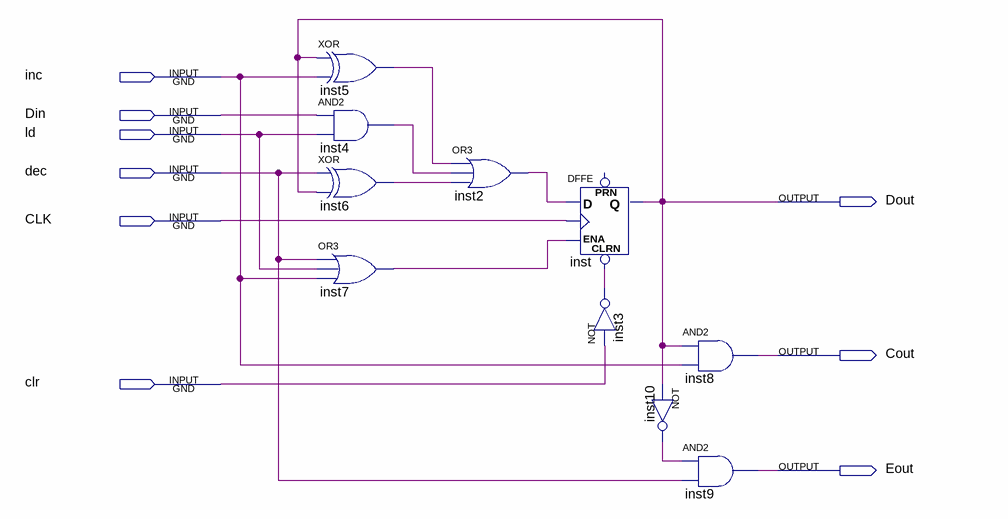
[diagram p0: schematic sheet]
// Quartus schematic reg1_ld_clr_inc_dec.bdf as structural Verilog: 10 symbols, 9 pins
module reg1_ld_clr_inc_dec (
  input  inc,
  input  Din,
  input  ld,
  input  dec,
  input  CLK,
  input  clr,
  output Dout,
  output Cout,
  output Eout
);

  wire inst2_out, inst3_out, inst4_out, inst5_out, inst6_out, inst7_out, inst10_out;

  xor inst5 (inst5_out, Dout, inc);
  and inst4 (inst4_out, Din, ld);
  xor inst6 (inst6_out, dec, Dout);
  or inst7 (inst7_out, dec, ld, inc);
  or inst2 (inst2_out, inst5_out, inst4_out, inst6_out);
  DFFE inst (.CLRN(inst3_out), .D(inst2_out), .CLK(CLK), .ENA(inst7_out), .Q(Dout));  // open: PRN
  not inst3 (inst3_out, clr);
  and inst8 (Cout, Dout, inc);
  not inst10 (inst10_out, Dout);
  and inst9 (Eout, inst10_out, dec);
endmodule
